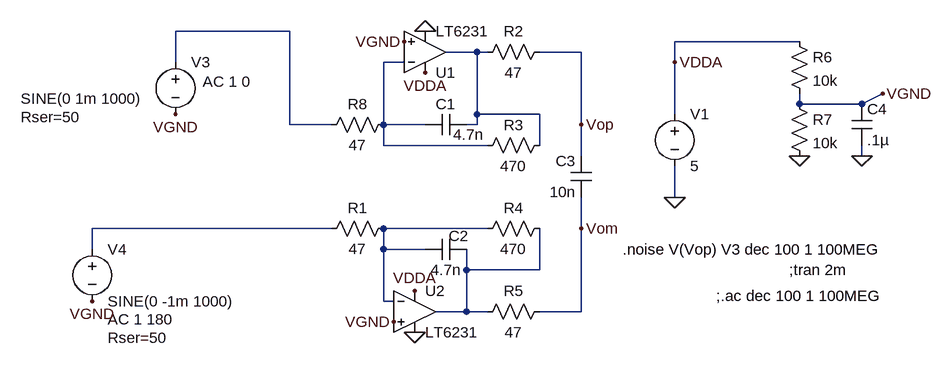
[diagram p0: schematic inverting-diff-amp-not-qmx.asc]
inverting-diff-amp-not-qmx.asc, the LTspice schematic file:
Version 4
SHEET 1 916 680
WIRE -80 -64 -256 -64
WIRE 704 -48 512 -48
WIRE 208 -32 160 -32
WIRE 224 -32 208 -32
WIRE 368 -32 304 -32
WIRE -256 -16 -256 -64
WIRE 96 -16 64 -16
WIRE 512 -16 512 -48
WIRE 704 48 704 32
WIRE 800 48 832 32
WIRE 800 48 704 48
WIRE 208 64 208 -32
WIRE 304 64 208 64
WIRE 512 64 512 -16
WIRE -80 80 -80 -64
WIRE -16 80 -80 80
WIRE 64 80 64 -16
WIRE 128 80 64 80
WIRE 208 80 208 64
WIRE 208 80 192 80
WIRE 368 80 368 -32
WIRE 64 112 64 80
WIRE 224 112 64 112
WIRE 304 112 304 64
WIRE 368 128 368 80
WIRE 800 128 800 112
WIRE 512 192 512 144
WIRE -16 240 -384 240
WIRE 224 240 64 240
WIRE 368 240 368 192
WIRE -384 272 -384 240
WIRE 64 272 64 240
WIRE 128 272 64 272
WIRE 192 304 192 272
WIRE 304 304 304 240
WIRE 304 304 192 304
WIRE 64 352 64 272
WIRE 80 352 64 352
WIRE 192 368 192 304
WIRE 192 368 144 368
WIRE 224 368 192 368
WIRE 368 368 368 240
WIRE 368 368 304 368
FLAG 512 -16 VDDA
FLAG 512 192 0
FLAG 128 0 VDDA
FLAG 112 336 VDDA
FLAG 128 -64 0
FLAG 112 400 0
FLAG 704 128 0
FLAG 832 32 VGND
FLAG -256 64 VGND
FLAG -384 352 VGND
FLAG 800 128 0
FLAG 368 80 Vop
FLAG 368 240 Vom
FLAG 96 -48 VGND
FLAG 80 384 VGND
SYMBOL OpAmps\\LT6231 128 -32 M180
SYMATTR InstName U1
SYMBOL OpAmps\\LT6231 112 368 R0
SYMATTR InstName U2
SYMBOL voltage 512 48 R0
WINDOW 123 0 0 Left 0
WINDOW 39 0 0 Left 0
SYMATTR InstName V1
SYMATTR Value 5
SYMBOL res 320 -48 R90
WINDOW 0 0 56 VBottom 2
WINDOW 3 32 56 VTop 2
SYMATTR InstName R2
SYMATTR Value 47
SYMBOL res 320 96 R90
WINDOW 0 0 56 VBottom 2
WINDOW 3 32 56 VTop 2
SYMATTR InstName R3
SYMATTR Value 470
SYMBOL res 320 224 R90
WINDOW 0 0 56 VBottom 2
WINDOW 3 32 56 VTop 2
SYMATTR InstName R4
SYMATTR Value 470
SYMBOL res 320 352 R90
WINDOW 0 0 56 VBottom 2
WINDOW 3 32 56 VTop 2
SYMATTR InstName R5
SYMATTR Value 47
SYMBOL cap 192 64 R90
WINDOW 0 0 32 VBottom 2
WINDOW 3 16 -3 VTop 2
SYMATTR InstName C1
SYMATTR Value 4.7n
SYMBOL cap 192 256 R90
WINDOW 0 11 12 VBottom 2
WINDOW 3 32 32 VTop 2
SYMATTR InstName C2
SYMATTR Value 4.7n
SYMBOL cap 384 192 R180
WINDOW 0 24 56 Left 2
WINDOW 3 24 8 Left 2
SYMATTR InstName C3
SYMATTR Value 10n
SYMBOL voltage -256 -32 R0
WINDOW 3 -238 72 Left 2
WINDOW 123 42 46 Left 2
WINDOW 39 -238 100 Left 2
SYMATTR Value SINE(0 1m 1000)
SYMATTR Value2 AC 1 0
SYMATTR SpiceLine Rser=50
SYMATTR InstName V3
SYMBOL voltage -384 256 R0
WINDOW 123 24 124 Left 2
WINDOW 39 24 152 Left 2
SYMATTR Value2 AC 1 180
SYMATTR SpiceLine Rser=50
SYMATTR InstName V4
SYMATTR Value SINE(0 -1m 1000)
SYMBOL res 688 -64 R0
SYMATTR InstName R6
SYMATTR Value 10k
SYMBOL res 688 32 R0
SYMATTR InstName R7
SYMATTR Value 10k
SYMBOL cap 784 48 R0
SYMATTR InstName C4
SYMATTR Value .1µ
SYMBOL res 80 224 R90
WINDOW 0 0 56 VBottom 2
WINDOW 3 32 56 VTop 2
SYMATTR InstName R1
SYMATTR Value 47
SYMBOL res 80 64 R90
WINDOW 0 0 56 VBottom 2
WINDOW 3 32 56 VTop 2
SYMATTR InstName R8
SYMATTR Value 47
TEXT 688 304 Left 2 !;tran 2m
TEXT 576 344 Left 2 !;.ac dec 100 1 100MEG
TEXT 432 272 Left 2 !.noise V(Vop) V3 dec 100 1 100MEG

The netlist it stands for:
* inverting-diff-amp-not-qmx.asc
XU1 VGND N003 N002 VDDA 0 LT6231  ; pins In+ In- OUT V+ V-
XU2 VGND N005 N006 VDDA 0 LT6231  ; pins In+ In- OUT V+ V-
V1 VDDA 0 5
R2 Vop N002 47
R3 N002 N003 470
R4 N006 N005 470
R5 Vom N006 47
C1 N002 N003 4.7n
C2 N006 N005 4.7n
C3 Vom Vop 10n
V3 N001 VGND SINE(0 1m 1000) AC 1 0 Rser=50
V4 N004 VGND SINE(0 -1m 1000) AC 1 180 Rser=50
R6 VDDA VGND 10k
R7 VGND 0 10k
C4 VGND 0 .1µ
R1 N005 N004 47
R8 N003 N001 47
;tran 2m
;.ac dec 100 1 100MEG
.noise V(Vop) V3 dec 100 1 100MEG
.lib LTC2.lib
.backanno
.end